# Altium schematic sheet Top_Level.SchDoc
size A; SheetNumber: 1; SheetTotal: 5
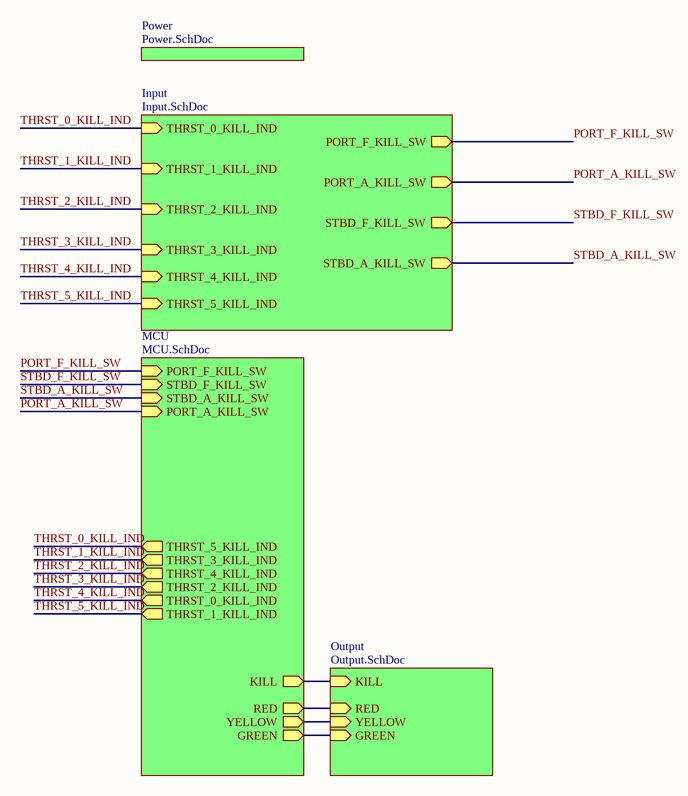
[diagram p0: Top_Level.SchDoc]

## Sub-sheets
Input = Input.SchDoc: PORT_F_KILL_SW (out), PORT_A_KILL_SW (out), STBD_F_KILL_SW (out), STBD_A_KILL_SW (out), THRST_0_KILL_IND (in), THRST_5_KILL_IND (in), THRST_4_KILL_IND (in), THRST_2_KILL_IND (in), THRST_3_KILL_IND (in), THRST_1_KILL_IND (in)
MCU = MCU.SchDoc: KILL (out), RED (out), GREEN (out), YELLOW (out), THRST_5_KILL_IND (out), THRST_3_KILL_IND (out), THRST_4_KILL_IND (out), THRST_2_KILL_IND (out), THRST_0_KILL_IND (out), THRST_1_KILL_IND (out), PORT_F_KILL_SW (in), STBD_F_KILL_SW (in), STBD_A_KILL_SW (in), PORT_A_KILL_SW (in)
Output = Output.SchDoc: KILL (in), RED (in), YELLOW (in), GREEN (in)
Power = Power.SchDoc: no entries

## Nets
PORT_A_KILL_SW: sheet Input/PORT_A_KILL_SW, sheet MCU/PORT_A_KILL_SW
PORT_F_KILL_SW: sheet Input/PORT_F_KILL_SW, sheet MCU/PORT_F_KILL_SW
STBD_A_KILL_SW: sheet Input/STBD_A_KILL_SW, sheet MCU/STBD_A_KILL_SW
STBD_F_KILL_SW: sheet Input/STBD_F_KILL_SW, sheet MCU/STBD_F_KILL_SW
THRST_0_KILL_IND: sheet Input/THRST_0_KILL_IND, sheet MCU/THRST_5_KILL_IND
THRST_1_KILL_IND: sheet Input/THRST_1_KILL_IND, sheet MCU/THRST_3_KILL_IND
THRST_2_KILL_IND: sheet Input/THRST_2_KILL_IND, sheet MCU/THRST_4_KILL_IND
THRST_3_KILL_IND: sheet Input/THRST_3_KILL_IND, sheet MCU/THRST_2_KILL_IND
THRST_4_KILL_IND: sheet Input/THRST_4_KILL_IND, sheet MCU/THRST_0_KILL_IND
THRST_5_KILL_IND: sheet Input/THRST_5_KILL_IND, sheet MCU/THRST_1_KILL_IND
(unnamed): sheet Output/KILL, sheet MCU/KILL
(unnamed): sheet Output/RED, sheet MCU/RED
(unnamed): sheet Output/YELLOW, sheet MCU/YELLOW
(unnamed): sheet Output/GREEN, sheet MCU/GREEN